# Altium schematic sheet Sheet1.SchDoc
size A3
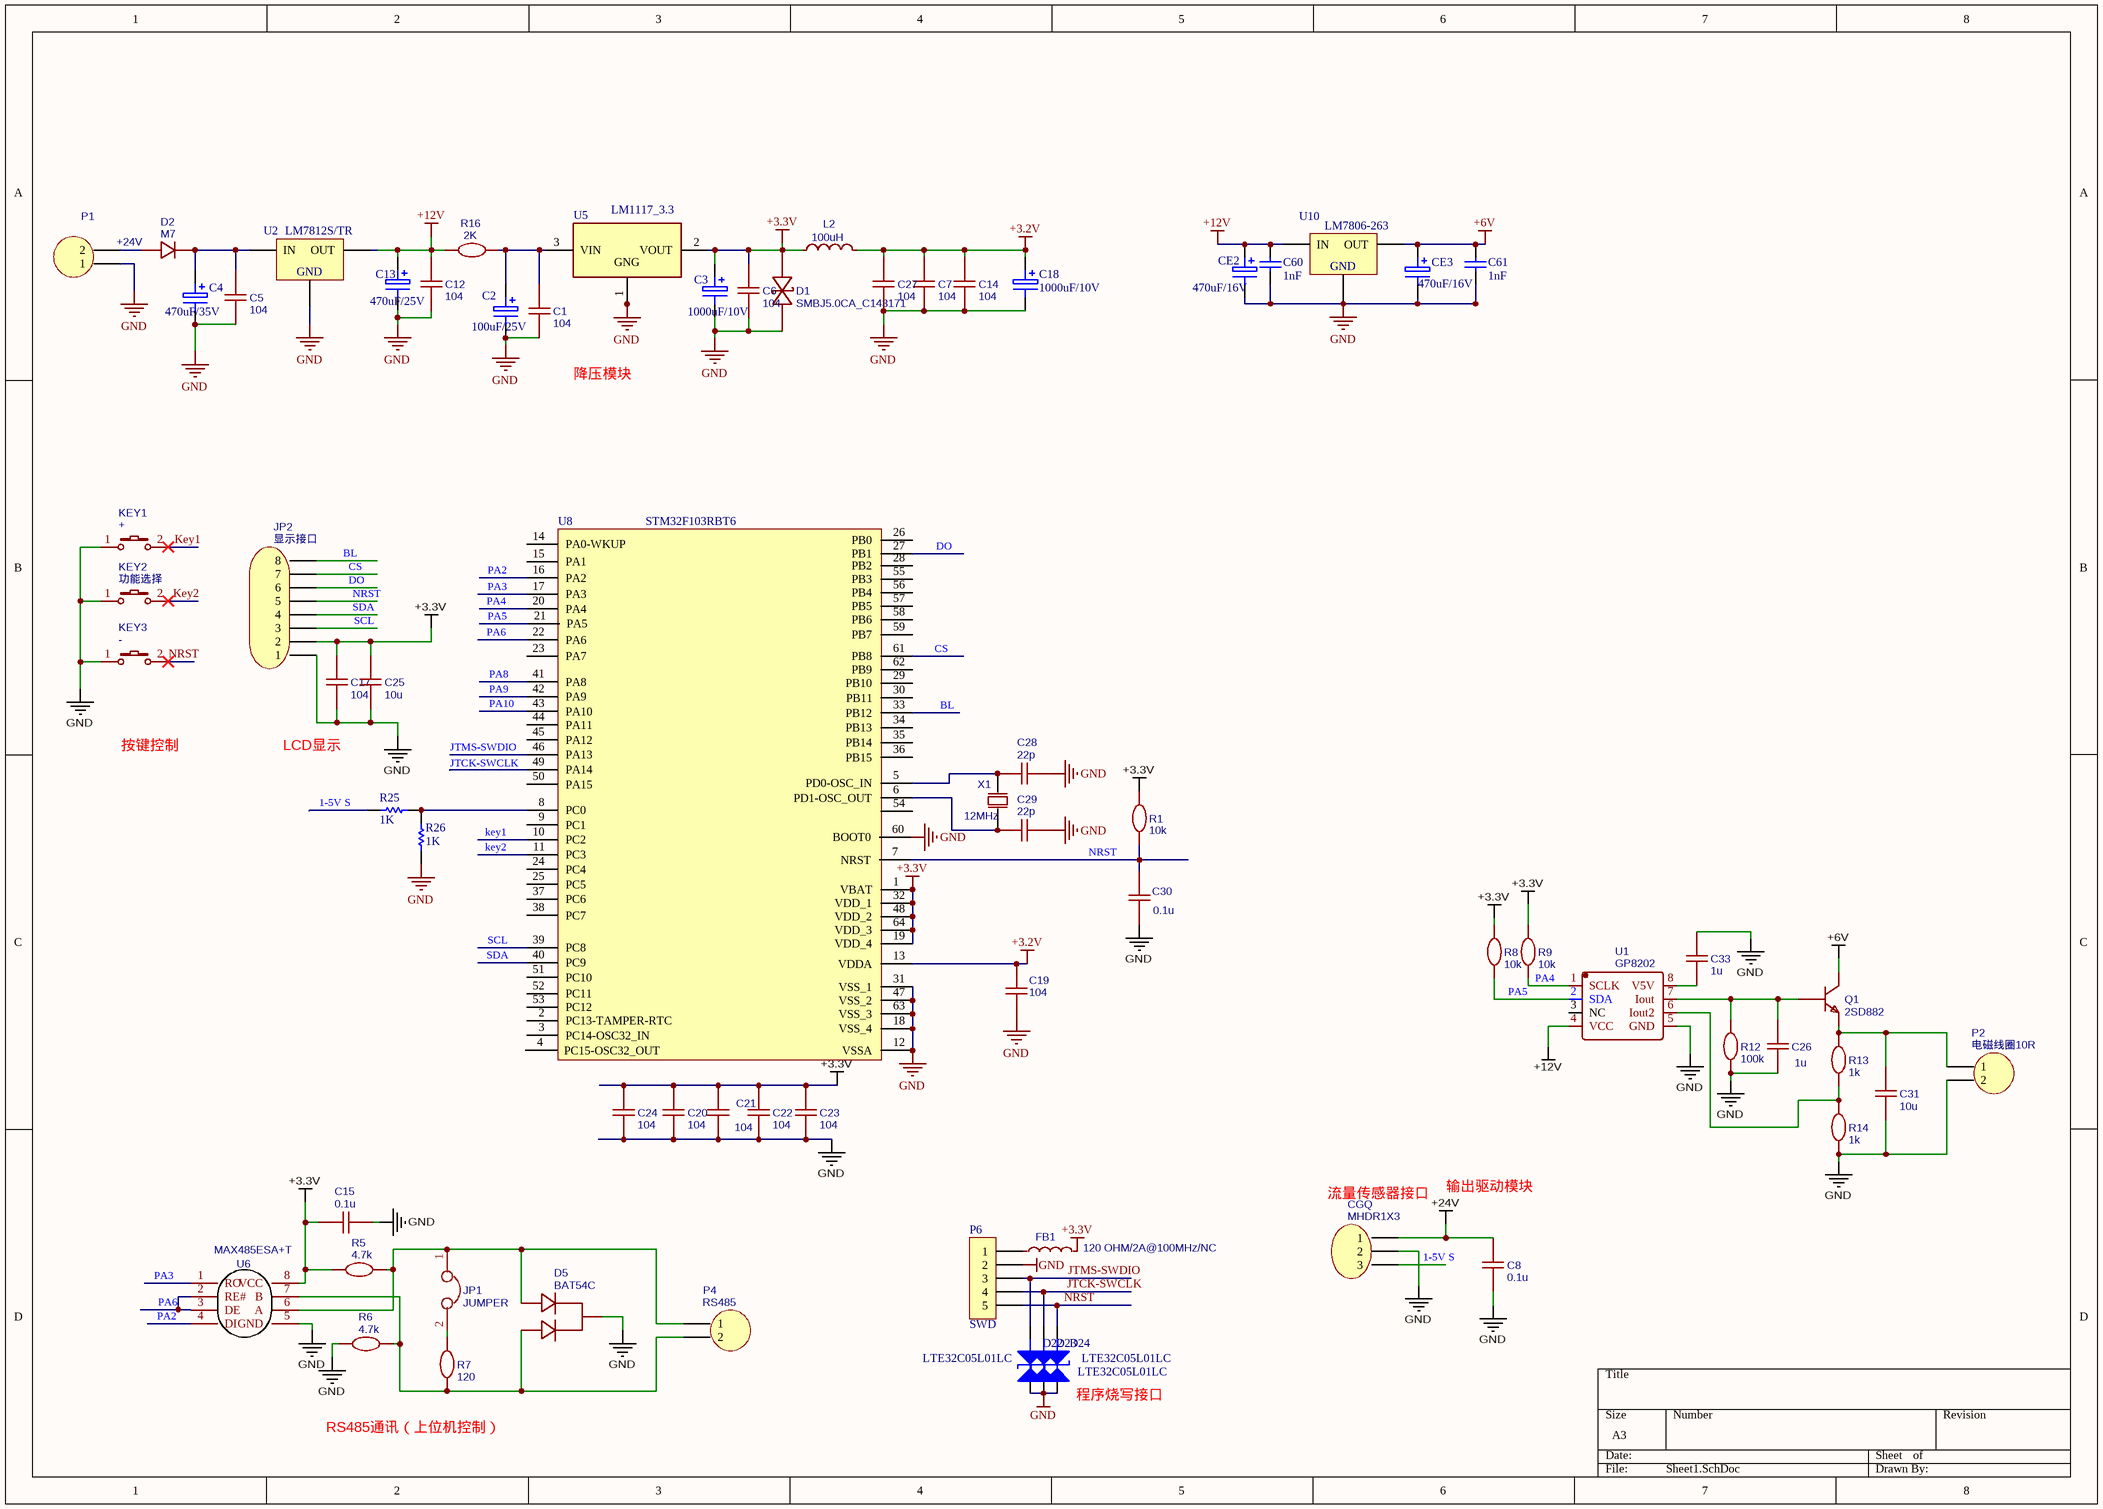
[diagram p0: Sheet1.SchDoc]

## Parts
C1  104  [0603C]
C2  value 100uF/25V  [C-0808-S]  (hidden comment: CAP1)
C3  value 1000uF/10V  [CAP-D6.3*H5.5]  (hidden comment: CAP1)
C4  value 470uF/35V  [C-0808-S]  (hidden comment: CAP1)
C5  104  [0603C]
C6  104  [0603C]
C7  104  [0603C]
C8  0.1u  [0603C]
C12  104  [0603C]
C13  value 470uF/25V  [C-0808-S]  (hidden comment: CAP1)
C14  104  [0603C]
C15  0.1u  [0603C]
C17  104  [0603C]
C18  value 1000uF/10V  [CAP-D6.3*H5.5]  (hidden comment: CAP1)
C19  104  [0603C]
C20  104  [0603C]
C21  104  [0603C]
C22  104  [0603C]
C23  104  [0603C]
C24  104  [0603C]
C25  10u  [0603C]
C26  1u  [0603C]
C27  104  [0603C]
C28  22p  [0603C]
C29  22p  [0603C]
C30  0.1u  [0603C]
C31  10u  [0603C]
C33  1u  [0603C]
C60  value 1nF  [0603C]  (hidden comment: Cap S1)
C61  value 1nF  [0603C]  (hidden comment: Cap S1)
CE2  value 470uF/16V  [C-0808-S]  (hidden comment: CAP1)
CE3  value 470uF/16V  [CAP-D6.3*H5.5]  (hidden comment: CAP1)
CGQ  MHDR1X3  [CON-3-2.5]
D1  SMBJ5.0CA_C143171  [1206D-N]
D2  M7  [0805D-1 - 1]
D5  BAT54C  [SOT-23A]
D22  LTE32C05L01LC  [SOD323]
D23  LTE32C05L01LC  [SOD323]
D24  LTE32C05L01LC  [SOD323]
FB1  120 OHM/2A@100MHz/NC  [SL0603]
JP1  JUMPER  [CON-2-2.0]
JP2  显示接口  [CON-8-2.5-1]
KEY1  +  [SW/2/SMT]
KEY2  功能选择  [SW/2/SMT]
KEY3  -  [SW/2/SMT]
L2  100uH  [1206R-1]
P1  +24V  [CON-2-2.0]
P2  电磁线圈10R  [CON-2-2.0]
P4  RS485  [CON-2-2.0]
P6  SWD  [CON5_2.5_1]
Q1  2SD882  [TO_252]
R1  10k  [0603R]
R5  4.7k  [0603R]
R6  4.7k  [0603R]
R7  120  [0603R]
R8  10k  [0603R]
R9  10k  [0603R]
R12  100k  [0603R]
R13  1k  [0603R]
R14  1k  [0603R]
R16  2K  [0805R-1]
R25  value 1K  [0603R]  (hidden comment: R1-S)
R26  value 1K  [0603R]  (hidden comment: R1-S)
U1  GP8202  [SO-8N]
U2  LM7812S/TR  [TO-263-3]
U5  LM1117_3.3  [SOT223-117]
U6  MAX485ESA+T  [SO-8N]
U8  STM32F103RBT6  [STM32F103RBT6]
U10  LM7806-263  [TO-263-3]
X1  12MHz  [SMD]

## Nets
+3.2V: C7.2 C14.2 C18.1 C19.2 C27.2 L2.2 U8.13(VDDA)
+3.3V: C3.1 C6.2 C15.1 C17.2 C20.2 C21.2 C22.2 C23.2 C24.2 C25.2 D1.2 FB1.2 JP2.2 L2.1 R1.2 R5.1 R8.2 R9.2 U5.2(VOUT) U6.8(VCC) U8.1(VBAT) U8.19(VDD_4) U8.32(VDD_1) U8.48(VDD_2) U8.64(VDD_3)
+6V: C61.2 CE3.1 Q1.2(C) U10.2(OUT)
+12V: C12.2 C13.1 C60.2 CE2.1 R16.2 U1.4(VCC) U2.2(OUT) U10.1(IN)
+24V: C8.2 CGQ.1
GND: C1.1 C2.2 C3.2 C4.2 C5.1 C6.1 C7.1 C8.1 C12.1 C13.2 C14.1 C15.2 C17.1 C18.2 C19.1 C20.1 C21.1 C22.1 C23.1 C24.1 C25.1 C26.1 C27.1 C28.2 C29.2 C30.1 C31.1 C33.2 C60.1 C61.1 CE2.2 CE3.2 CGQ.2 D1.1 D5.3(K) D22.2(K) D23.2(K) D24.2(K) JP2.1 KEY1.1 KEY2.1 KEY3.1 P1.1 P2.2 P6.2 R6.1 R12.1 R14.1 R26.1 U1.5(GND) U2.3(GND) U5.1(GNG) U6.5(GND) U8.12(VSSA) U8.18(VSS_4) U8.31(VSS_1) U8.47(VSS_2) U8.60(BOOT0) U8.63(VSS_3)
1-5V S: CGQ.3 R25.1
BL: JP2.8 U8.33(PB12)
CS: JP2.7 U8.61(PB8)
DO: JP2.6 U8.27(PB1)
JTCK-SWCLK: D23.1(A) P6.4 U8.49(PA14)
JTMS-SWDIO: D22.1(A) P6.3 U8.46(PA13)
key1: KEY1.2 U8.10(PC2)
key2: KEY2.2 U8.11(PC3)
NRST: C30.2 D24.1(A) JP2.5 KEY3.2 P6.5 R1.1 U8.7(NRST)
PA2: U6.4(DI) U8.16(PA2)
PA3: U6.1(RO) U8.17(PA3)
PA4: R9.1 U1.1(SCLK) U8.20(PA4)
PA5: R8.1 U1.2(SDA) U8.21(PA5)
PA6: U6.2(RE#) U6.3(DE) U8.22(PA6)
PA8: U8.41(PA8)
PA9: U8.42(PA9)
PA10: U8.43(PA10)
SCL: JP2.3 U8.39(PC8)
SDA: JP2.4 U8.40(PC9)
NetC1_2: C1.2 C2.1 R16.1 U5.3(VIN)
NetC4_1: C4.1 C5.2 D2.1 U2.1(IN)
NetC26_2: C26.2 Q1.1(B) R12.2 U1.7(Iout)
NetC28_1: C28.1 U8.5(PD0-OSC_IN) X1.2(OSC2)
NetC29_1: C29.1 U8.6(PD1-OSC_OUT) X1.1(OSC1)
NetC31_2: C31.2 P2.1 Q1.3(E) R13.2
NetC33_1: C33.1 U1.8(V5V)
NetD2_2: D2.2 P1.2
NetD5_1: D5.1(A1) JP1.1 P4.1 R5.2 U6.6(A)
NetD5_2: D5.2(A2) P4.2 R6.2 R7.1 U6.7(B)
NetFB1_1: FB1.1 P6.1
NetJP1_2: JP1.2 R7.2
NetR13_1: R13.1 R14.2 U1.6(Iout2)
NetR25_2: R25.2 R26.2 U8.8(PC0)

Not connected (* = marked no-connect by the designer): U1 3(NC); U8 2(PC13-TAMPER-RTC) 3(PC14-OSC32_IN) 4(PC15-OSC32_OUT) 9(PC1) 14(PA0-WKUP) 15(PA1) 23(PA7) 24(PC4) 25(PC5) 26(PB0) 28(PB2) 29(PB10) 30(PB11) 34(PB13) 35(PB14) 36(PB15) 37(PC6) 38(PC7) 44(PA11) 45(PA12) 50(PA15) 51(PC10) 52(PC11) 53(PC12) 54 55(PB3) 56(PB4) 57(PB5) 58(PB6) 59(PB7) 62(PB9); U10 3(GND)

## Notes on the sheet
- 降压模块
- 按键控制
- LCD显示
- 输出驱动模块
- (near CGQ) 流量传感器接口
- (near R7) RS485通讯（上位机控制）
- 程序烧写接口

## Library data of the parts
C1 C5-C7 C12 C14 C17 C19-C24 C27 = 104: nameAlias: Value(F); Contributor: LCEDA_Lib; spicePre: C
  C1 C5-C7 C12 C14 C19-C24 C27: spiceSymbolName: C_0201_US
  C17: spiceSymbolName: C_RAD-0.3_US
C2-C4 C13 C18 CE2 CE3 = CAP1: 10uF/16V
C8 C15 C30 = 0.1u: nameAlias: Value(F); Contributor: LCEDA_Lib; spicePre: C; spiceSymbolName: C_0201_US
C25 C31 = 10u: nameAlias: Value(F); Contributor: LCEDA_Lib; spicePre: C; spiceSymbolName: C_RAD-0.3_US
C26 C33 = 1u: nameAlias: Value(F); Contributor: LCEDA_Lib; spicePre: C; spiceSymbolName: C_RAD-0.3_US
C28 C29 = 22p: nameAlias: Value(F); Contributor: LCEDA_Lib; spicePre: C; spiceSymbolName: C_0201_US
C60 C61 = Cap S1: 1nF; LatestRevisionDate: 17-Jul-2002; LatestRevisionNote: Re-released for DXP Platform.; PackageReference: C1206; Published: 8-Jun-2000; Publisher: Altium Limited
CGQ = MHDR1X3: Contributor: 实验室提取; spicePre: P; spiceSymbolName: MHDR1X3
D1 = SMBJ5.0CA_C143171: BOM_Manufacturer: FMS; Contributor: LCSC; BOM_Paste Type: expand; BOM_Assembly Type: smtWeld; BOM_Supplier Part: C143171; BOM_Supplier: LCSC; BOM_Manufacturer Part: SMBJ5.0CA; spicePre: D; spiceSymbolName: SMBJ5.0CA_C143171
D2 = M7: BOM_Manufacturer: Bourne Semicon (Shenzhen); Contributor: LCSC; BOM_Paste Type: expand; BOM_Supplier: LCSC; BOM_Supplier Part: C266550; BOM_Manufacturer Part: M7; spicePre: D; spiceSymbolName: M7
D5 = BAT54C: BOM_Manufacturer: CJ; BOM_Supplier: LCSC; BOM_Manufacturer Part: BAT54C; image: //image.lceda.cn/szlcsc/C2135.jpg; BOM_Supplier Part: C2135; spicePre: D; spiceSymbolName: BAT54C
D22-D24 = ZENER2: Zener Diode
FB1 = 120 OHM/2A@100MHz: BOM_Manufacturer: MuRata; BOM_Manufacturer Part: BLM18PG121SN1D; nameAlias: Value; BOM_Supplier: LCSC; BOM_Supplier Part: C73100; BOM_LCSC Assembly: Yes; spicePre: L; spiceSymbolName: BLM18PG121SN1D
JP1 = JUMPER: Contributor: KiCad; spicePre: J; spiceSymbolName: JUMPER
JP2 = 显示接口: Contributor: upjzk; LatestRevisionDate: 17-Jul-2002; LatestRevisionNote: Re-released for DXP Platform.; Publisher: Altium Limited; spicePre: J; spiceSymbolName: MHDR1X8
KEY1 = +: BOM_Manufacturer Part: K2-1107ST-A4SW-06; Contributor: LCEDA_Lib; 制造商: 韩国韩荣; BOM_Supplier Part: C118141; BOM_Supplier: LCSC; spicePre: K; spiceSymbolName: K2-3.6×6.1_SMD
KEY2 = 功能选择: BOM_Manufacturer Part: K2-1107ST-A4SW-06; Contributor: LCEDA_Lib; 制造商: 韩国韩荣; BOM_Supplier Part: C118141; BOM_Supplier: LCSC; spicePre: K; spiceSymbolName: K2-3.6×6.1_SMD
KEY3 = -: BOM_Manufacturer Part: K2-1107ST-A4SW-06; Contributor: LCEDA_Lib; 制造商: 韩国韩荣; BOM_Supplier Part: C118141; BOM_Supplier: LCSC; spicePre: K; spiceSymbolName: K2-3.6×6.1_SMD
L2 = 100uH: nameAlias: Value(H); Contributor: LCEDA_Lib; spicePre: L; spiceSymbolName: L0402_US
P1 = +24V: Contributor: ruichenxing; LatestRevisionDate: 17-Jul-2002; LatestRevisionNote: Re-released for DXP Platform.; Publisher: Altium Limited; spicePre: P; spiceSymbolName: MHDR1X2
P2 = 电磁线圈10R: Contributor: ruichenxing; LatestRevisionDate: 17-Jul-2002; LatestRevisionNote: Re-released for DXP Platform.; Publisher: Altium Limited; spicePre: P; spiceSymbolName: MHDR1X2
P4 = RS485: Contributor: ruichenxing; LatestRevisionDate: 17-Jul-2002; LatestRevisionNote: Re-released for DXP Platform.; Publisher: Altium Limited; spicePre: P; spiceSymbolName: MHDR1X2
P6 = CON5: Connector
Q1 = 2SD882: BOM_Manufacturer: UTC; BOM_Manufacturer Part: 2SD882SG-P-AB3-R; Contributor: LCSC; BOM_Paste Type: expand; BOM_Supplier: LCSC; BOM_Supplier Part: C146663; spicePre: Q; spiceSymbolName: 2SD882SG-P-AB3-R
R1 R8 R9 R16 = 10k: nameAlias: Value(Ω); Contributor: LCEDA_Lib; spicePre: R; spiceSymbolName: R_0201_EU
R5 R6 = 4.7k: nameAlias: Value(Ω); Contributor: LCEDA_Lib; spicePre: R; spiceSymbolName: R_0201_EU
R7 = 120: nameAlias: Value(Ω); Contributor: LCEDA_Lib; spicePre: R; spiceSymbolName: R_0201_EU
R12 = 100k: nameAlias: Value(Ω); Contributor: LCEDA_Lib; spicePre: R; spiceSymbolName: R_0201_EU
R13 R14 = 1k: nameAlias: Value(Ω); Contributor: LCEDA_Lib; spicePre: R; spiceSymbolName: R_0201_EU
U1 = GP8202: BOM_Manufacturer: 上海客益电子; Contributor: lwl887; BOM_Supplier: 上海客益电子; BOM_Supplier Part: C185850; BOM_Manufacturer Part: GP8202; link: https://item.taobao.com/item.htm?spm=a1z09.2.0.0.36de2e8dWTzzRt&id=606193465154&_u=c1oaff7c1ec; spicePre: U; spiceSymbolName: GP8202
U2 U10 = LM7805-263
U5 = LM1117_3.3: 稳压
U6 = MAX485ESA+T: BOM_Manufacturer: MAXIM; SMT Type: Extend; BOM_Supplier: LCSC; BOM_Manufacturer Part: MAX485ESA+T; image: //image.lceda.cn/szlcsc/C19738.jpg; BOM_Supplier Part: C19738; BOM_JLCPCB SMD: Yes; spicePre: U; spiceSymbolName: MAX485ESA+T
X1 = 12MHz: BOM_Manufacturer: HOSONIC; BOM_Manufacturer Part: E49A12E00000WE10C0; nameAlias: Frequency; BOM_Supplier: LCSC; BOM_Supplier Part: C115439; spicePre: X; spiceSymbolName: E49A12E00000WE10C0
R25 R26 = R1-S: Published: 8-Jun-2000; LatestRevisionDate: 17-Jul-2002; LatestRevisionNote: Re-released for DXP Platform.; PackageReference: AXIAL-0.5; Publisher: Altium Limited